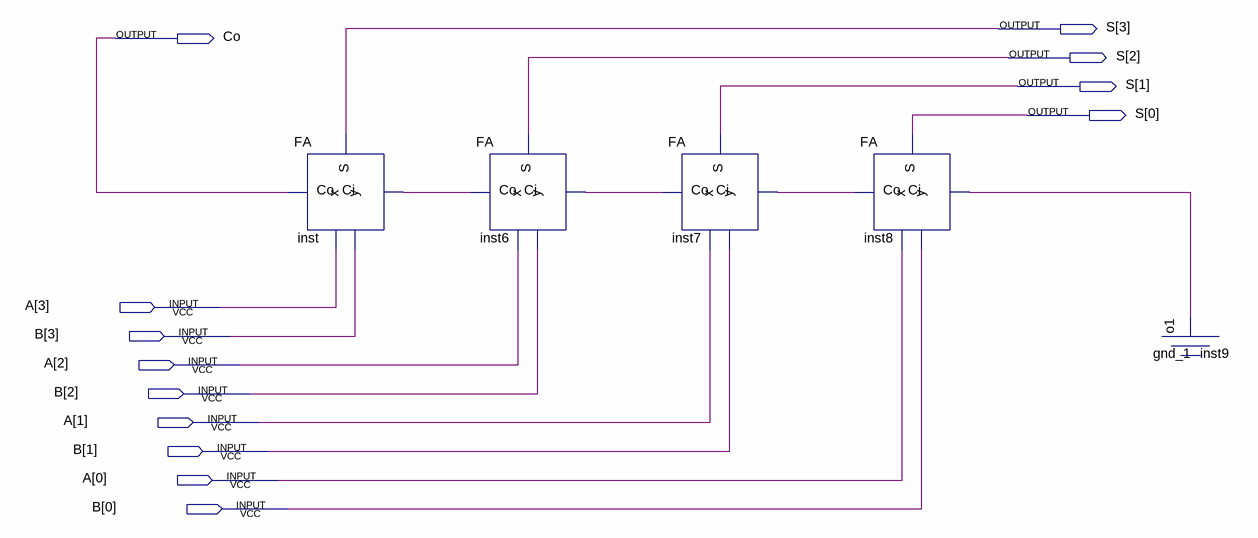
[diagram p0: schematic sheet]
// Quartus schematic FA4.bdf as structural Verilog: 5 symbols, 13 pins
module FA4 (
  input  [3:0] A,
  input  [3:0] B,
  output [3:0] S,
  output Co
);

  wire inst6_co, inst7_co, inst8_co, inst9_o1;

  FA inst (.Ci(inst6_co), .x(A[3]), .y(B[3]), .Co(Co), .S(S[3]));
  FA inst6 (.Ci(inst7_co), .x(A[2]), .y(B[2]), .Co(inst6_co), .S(S[2]));
  FA inst7 (.Ci(inst8_co), .x(A[1]), .y(B[1]), .Co(inst7_co), .S(S[1]));
  FA inst8 (.Ci(inst9_o1), .x(A[0]), .y(B[0]), .Co(inst8_co), .S(S[0]));
  gnd_1 inst9 (.o1(inst9_o1));
endmodule
